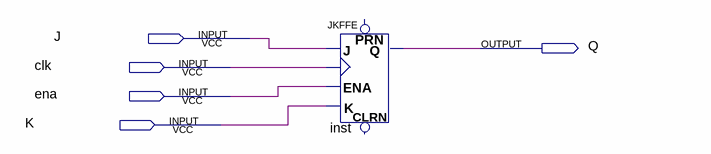
[diagram p0: schematic sheet]
// Quartus schematic jkffe_altera.bdf as structural Verilog: 1 symbols, 5 pins
module jkffe_altera (
  input  J,
  input  clk,
  input  ena,
  input  K,
  output Q
);

  JKFFE inst (.J(J), .CLK(clk), .K(K), .ENA(ena), .Q(Q));  // open: PRN, CLRN
endmodule
